# Altium schematic sheet Leandro_Board.SchDoc
size A
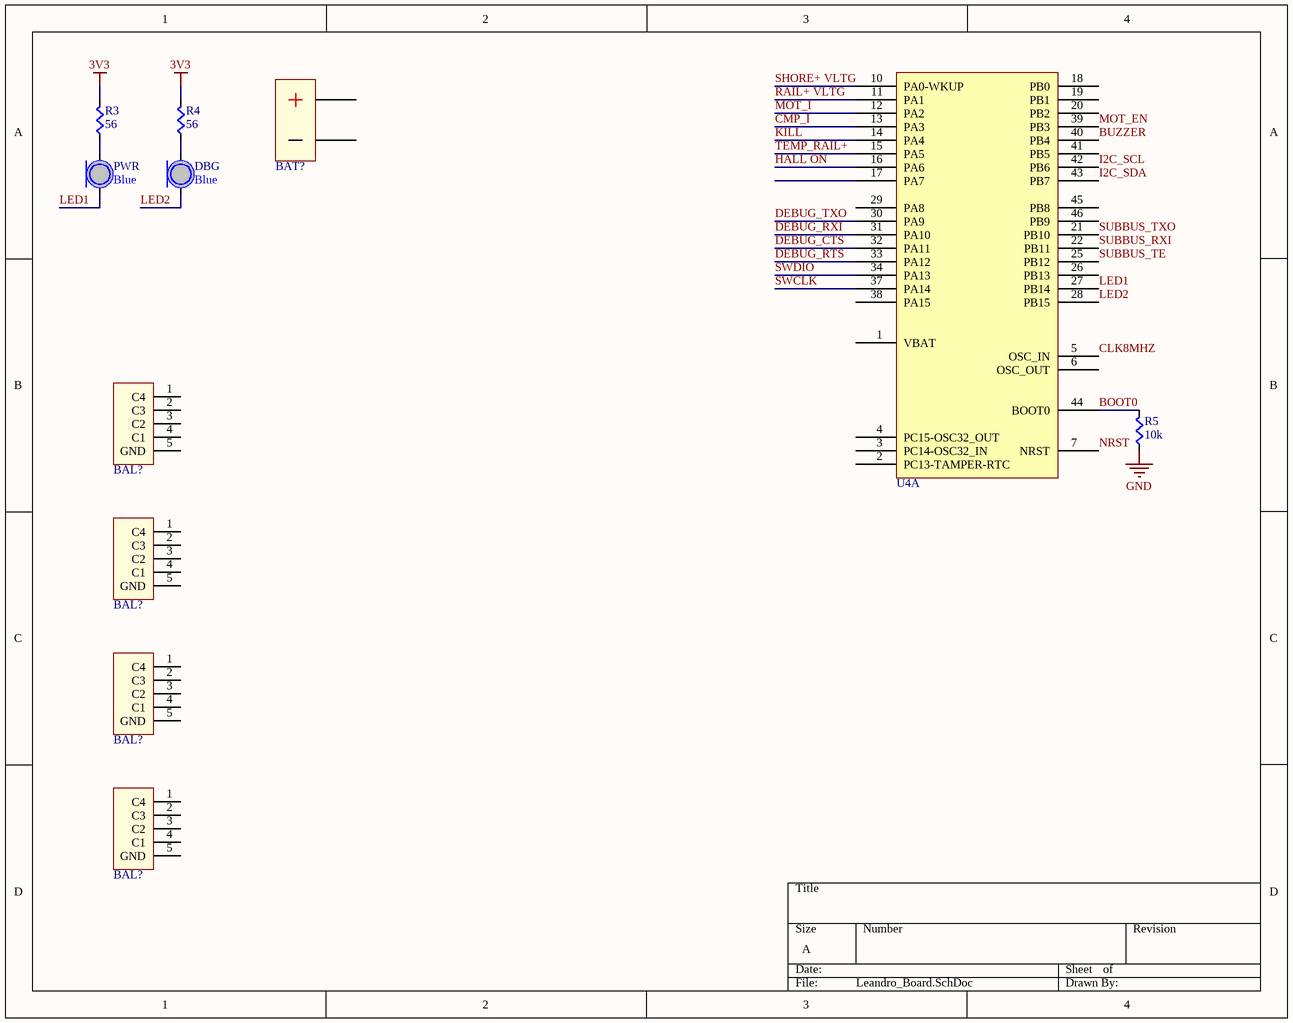
[diagram p0: Leandro_Board.SchDoc]

## Parts
(Parts that share a designator on the sheet are numbered #1, #2 ... from top to bottom, then left to right.)
BAL?#1  JST1x5  (value not drawn)
BAL?#2  JST1x5  (value not drawn)
BAL?#3  JST1x5  (value not drawn)
BAL?#4  JST1x5  (value not drawn)
BAT?  BATWIRE  [BATWIRE12]  (value not drawn)
DBG  Color: Blue  [LED0805]  (hidden comment: LED)
PWR  Color: Blue  [LED0805]  (hidden comment: LED)
R3  value 56  [RES0603]  (hidden comment: Res)
R4  value 56  [RES0603]  (hidden comment: Res)
R5  value 10k  [RES0603]  (hidden comment: Res)
U4  STM32F103C8T7  [STM32F103C8T7]  (value not drawn)  (part A of 2)

## Nets
3V3: R3.1(A) R4.1(A)
GND: R5.2(B)
BOOT0: R5.1(A) U4.44(BOOT0)
BUZZER: U4.40(PB4)
CLK8MHZ: U4.5(OSC_IN)
CMP_I: U4.13(PA3)
DEBUG_CTS: U4.32(PA11)
DEBUG_RTS: U4.33(PA12)
DEBUG_RXI: U4.31(PA10)
DEBUG_TXO: U4.30(PA9)
HALL ON: U4.16(PA6)
I2C_SCL: U4.42(PB6)
I2C_SDA: U4.43(PB7)
KILL: U4.14(PA4)
LED1: PWR.C U4.27(PB14)
LED2: DBG.C U4.28(PB15)
MOT_EN: U4.39(PB3)
MOT_I: U4.12(PA2)
NRST: U4.7(NRST)
RAIL+ VLTG: U4.11(PA1)
SHORE+ VLTG: U4.10(PA0-WKUP)
SUBBUS_RXI: U4.22(PB11)
SUBBUS_TE: U4.25(PB12)
SUBBUS_TXO: U4.21(PB10)
SWCLK: U4.37(PA14)
SWDIO: U4.34(PA13)
TEMP_RAIL+: U4.15(PA5)
NetDBG_A: DBG.A R4.2(B)
NetPWR_A: PWR.A R3.2(B)

Not connected (* = marked no-connect by the designer): BAL?#1 1(C4) 2(C3) 3(C2) 4(C1) 5(GND); BAL?#2 1(C4) 2(C3) 3(C2) 4(C1) 5(GND); BAL?#3 1(C4) 2(C3) 3(C2) 4(C1) 5(GND); BAL?#4 1(C4) 2(C3) 3(C2) 4(C1) 5(GND); BAT? + -; U4 1(VBAT) 2(PC13-TAMPER-RTC) 3(PC14-OSC32_IN) 4(PC15-OSC32_OUT) 6(OSC_OUT) 17(PA7) 18(PB0) 19(PB1) 20(PB2) 26(PB13) 29(PA8) 38(PA15) 41(PB5) 45(PB8) 46(PB9)

## Library data of the parts
BAT? = BATWIRE: Two large gauge leads soldered directly to the board.
U4 = STM32F103C8T7: MCU ARM 32BIT 64K FLASH 48-LQFP; Supplier 1: Digi-Key; Supplier Part Number 1: 497-11517-ND
DBG PWR = LED: Supplier 1: Digi-Key; Supplier Part Number 1: 350-2046-1-ND
R3-R5 = Res: Supplier 1: Digi-Key
  R3 R4: Supplier Part Number 1: RMCF0603JT56R0CT-ND
  R5: Supplier Part Number 1: RMCF0603JT10K0CT-ND